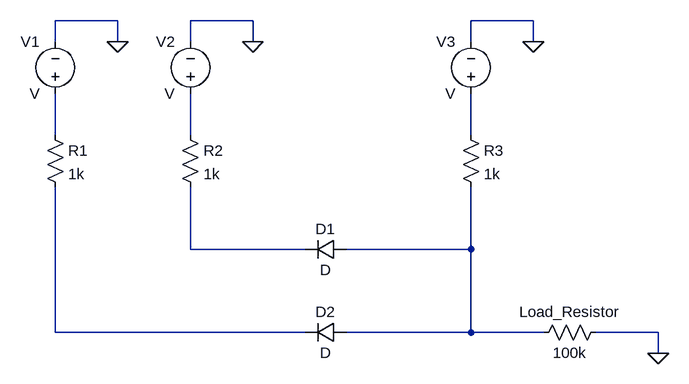
[diagram p0: schematic Experiment 4.asc]
Experiment 4.asc, the LTspice schematic file:
Version 4
SHEET 1 880 680
WIRE 0 -112 -96 -112
WIRE 208 -112 112 -112
WIRE 640 -112 544 -112
WIRE -96 -80 -96 -112
WIRE 0 -80 0 -112
WIRE 112 -80 112 -112
WIRE 208 -80 208 -112
WIRE 544 -80 544 -112
WIRE 640 -80 640 -112
WIRE -96 64 -96 0
WIRE 112 64 112 0
WIRE 544 64 544 0
WIRE 112 240 112 144
WIRE 288 240 112 240
WIRE 544 240 544 144
WIRE 544 240 352 240
WIRE -96 368 -96 144
WIRE 288 368 -96 368
WIRE 544 368 544 240
WIRE 544 368 352 368
WIRE 656 368 544 368
WIRE 832 368 736 368
WIRE 832 400 832 368
FLAG 640 -80 0
FLAG 208 -80 0
FLAG 0 -80 0
FLAG 832 400 0
SYMBOL voltage -96 16 R180
WINDOW 0 24 96 Left 2
WINDOW 3 24 16 Left 2
SYMATTR InstName V1
SYMBOL voltage 112 16 R180
WINDOW 0 24 96 Left 2
WINDOW 3 24 16 Left 2
SYMATTR InstName V2
SYMBOL voltage 544 16 R180
WINDOW 0 24 96 Left 2
WINDOW 3 24 16 Left 2
SYMATTR InstName V3
SYMBOL res -112 48 R0
SYMATTR InstName R1
SYMATTR Value 1k
SYMBOL res 96 48 R0
SYMATTR InstName R2
SYMATTR Value 1k
SYMBOL res 528 48 R0
SYMATTR InstName R3
SYMATTR Value 1k
SYMBOL res 640 384 R270
WINDOW 0 32 56 VTop 2
WINDOW 3 0 56 VBottom 2
SYMATTR InstName Load_Resistor
SYMATTR Value 100k
SYMBOL diode 352 224 R90
WINDOW 0 0 32 VBottom 2
WINDOW 3 32 32 VTop 2
SYMATTR InstName D1
SYMBOL diode 352 352 R90
WINDOW 0 0 32 VBottom 2
WINDOW 3 32 32 VTop 2
SYMATTR InstName D2

The netlist it stands for:
* Experiment 4.asc
V1 N001 0 V
V2 N002 0 V
V3 N003 0 V
R1 N001 N006 1k
R2 N002 N004 1k
R3 N003 N005 1k
R§Load_Resistor N005 0 100k
D1 N005 N004 D
D2 N005 N006 D
.model D D
.lib standard.dio
.backanno
.end